# Altium schematic sheet Mechanical Interfacing.SchDoc: Mechanical Interfacing
size Letter; Author: Nicholas J. Sorensen; Engineer: Nicholas J. Sorensen; DocumentNumber: 4; SheetNumber: 4; SheetTotal: 4
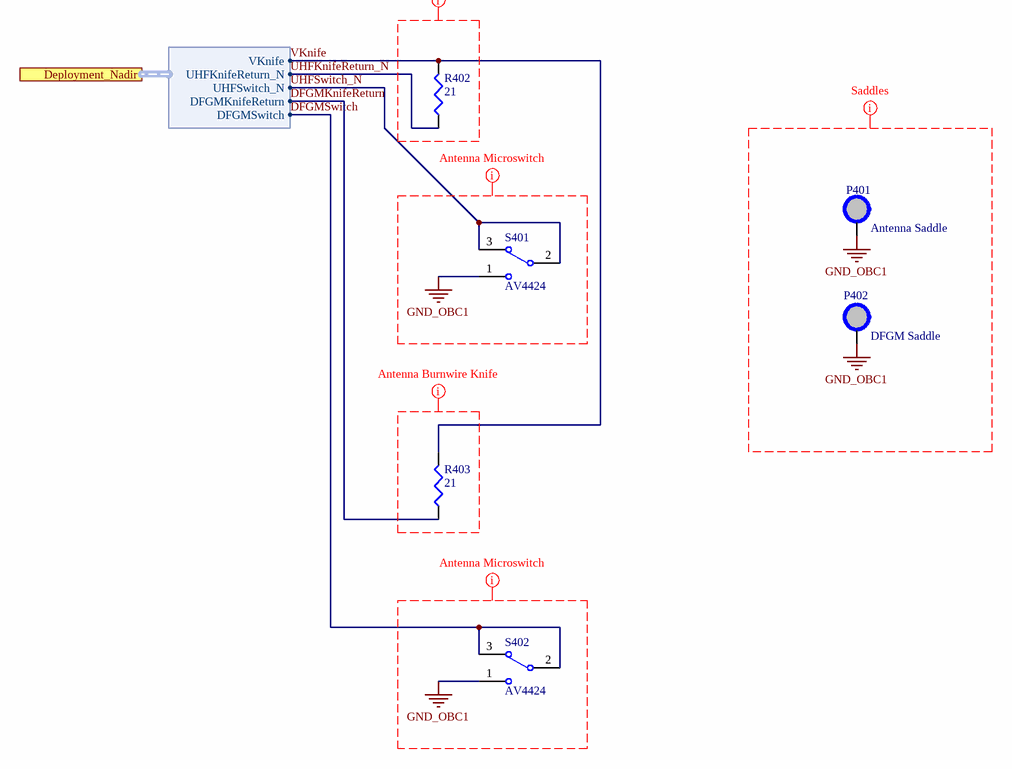
[diagram p0: Mechanical Interfacing.SchDoc]

## Parts
P401  Antenna Saddle  [ANTENNA_SADDLE]
P402  DFGM Saddle  [DFGM_Saddle]
R402  value 21  [VSH-CPF1]  (hidden comment: Res3)
R403  value 21  [VSH-CPF1]  (hidden comment: Res3)
S401  AV4424  [PANA-AV4424]
S402  AV4424  [PANA-AV4424]

## Ports
Deployment_Nadir (harness Deployment_Nadir)

## Harnesses
Deployment_Nadir: UHFSwitch_N, UHFKnifeReturn_N, VKnife, DFGMKnifeReturn, DFGMSwitch

## Nets
GND_OBC1: P401.1 P402.1 S401.1(NO) S402.1(NO)
DFGMKnifeReturn: R403.1 ; port Deployment_Nadir.DFGMKnifeReturn
DFGMSwitch: S402.2(COM) S402.3(NC) ; port Deployment_Nadir.DFGMSwitch
UHFKnifeReturn_N: R402.1 ; port Deployment_Nadir.UHFKnifeReturn_N
UHFSwitch_N: S401.2(COM) S401.3(NC) ; port Deployment_Nadir.UHFSwitch_N
VKnife: R402.2 R403.2 ; port Deployment_Nadir.VKnife

## Layout directives
mark named Antenna Burnwire Knife: (no net found under the mark)
mark named Antenna Microswitch: GND_OBC1
mark named Saddles: GND_OBC1

## Notes on the sheet
- (the "License"); you may not use or redistribute this file except in compliance with the License. You
- This file and the information within it are licensed under the terms of the Apache License, Version 2.0
- Copyright
- Unless required by applicable law or agreed to in writing, content distributed under the License is
- distributed on an "AS IS" BASIS, WITHOUT WARRANTIES OR CONDITIONS OF ANY KIND,
- either express or implied. See the License for the specific language governing permissions and
- limitations under the License.
- may obtain a copy of the License at:
- http://www.apache.org/licenses/LICENSE-2.0
- Title
- Size:
- Date:
- Letter
- Number:
- Time:
- Revision:
- Sheet
- of
- University of Alberta
- Deptartment of Electrical
- and Computer Engineering
- Edmonton AB, Canada
- T6G 1H9
- File:

## Library data of the parts
P401 = PXX-ABS-00001: Manufacturer Part Number: Custom; Index: 1; Designator: M?; Part Number: PXX-ABS-00001; Supplier 1: Digi-key; Publisher: AlbertaSat; LatestRevisionNote: ...
P402 = PXX-ABS-00010: Manufacturer Part Number: Custom; Index: 10; Designator: P?; Part Number: PXX-ABS-00010; Supplier 1: Digi-key; Publisher: AlbertaSat; LatestRevisionNote: ...
R402 R403 = PR-VSH-00317: 21 Ohms ±1% 1W Through Hole Resistor Axial Flame Proof, Moisture Resistant, Safety Metal Film; Manufacturer Part Number: CPF121R000FKEE6; Index: 317; Designator: R?; Temperature Coefficient: ±100ppm/°C; Published: 2/27/2020; LatestRevisionDate: 2/27/2020; LatestRevisionNote: ...; PackageReference: VSH-CPF1; Publisher: AlbertaSat; PackageDescription: Chip Resistor; Part Number: PR-VSH-00317; Supplier Part Number 1: CPF21.0CCT-ND; Supplier 1: Digi-key; Supplier Link: #https://www.digikey.ca/product-detail/en/vishay-dale/CPF121R000FKEE6/CPF21.0CCT-ND/2713126#; Tolerance: ±1%; Power - Rated: 1W
S401 S402 = 20035: SWITCH SNAP ACT SPDT 500MA 30V; Part Number: 20035; Manufacturer Part Number: AV4424; Supplier Part Number 1: 255-3743-ND; Supplier 1: Digi-Key; Supplier Link: #https://www.digikey.com/product-detail/en/panasonic-electric-works/AV4424/255-3743-ND/646766#